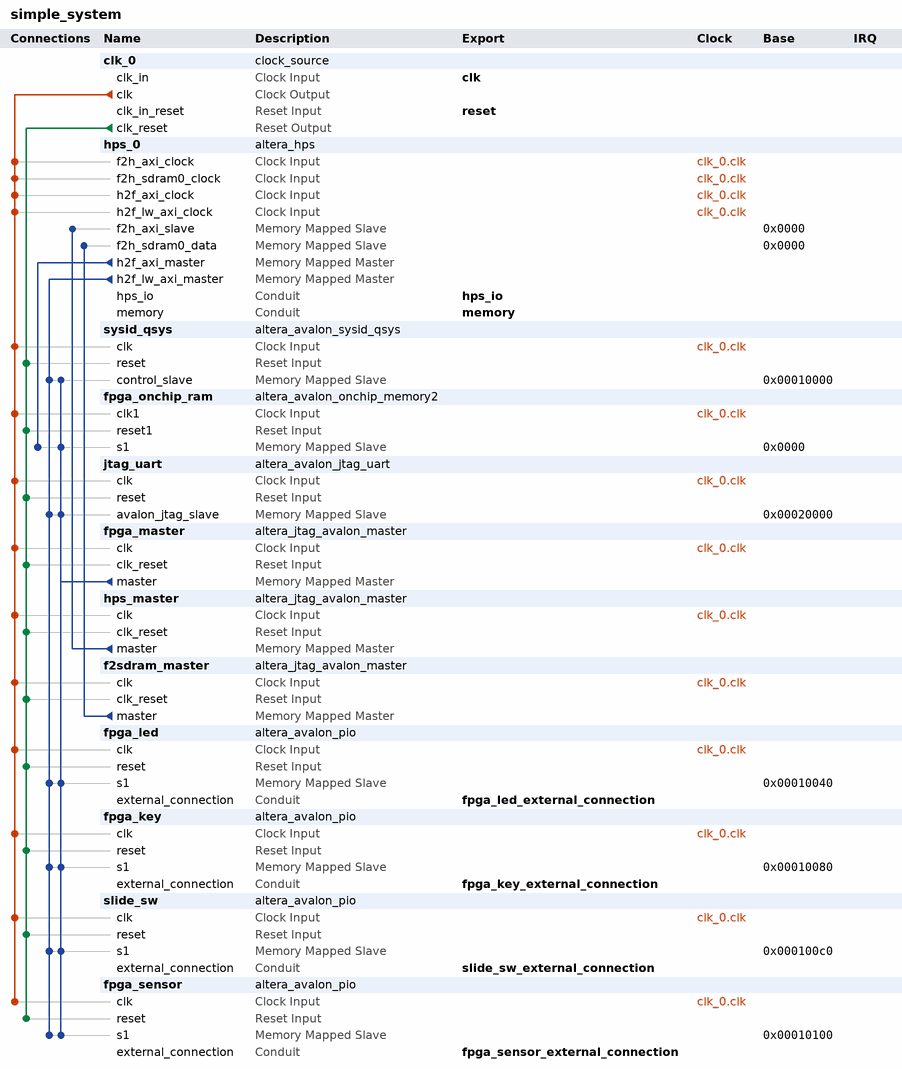
[diagram p0: system contents]
# Platform Designer (Qsys) system simple_system, Cyclone V 5CSXFC6C6U23C6
# Parameters at their usual value, and those the tool derives, are not listed.
package require -exact qsys 13.1
create_system simple_system
set_project_property DEVICE_FAMILY {Cyclone V}
set_project_property DEVICE 5CSXFC6C6U23C6

add_instance clk_0 clock_source 13.1
set_instance_parameter_value clk_0 clockFrequency 25000000

add_instance hps_0 altera_hps 13.1
set_instance_parameter_value hps_0 MEM_VENDOR JEDEC
set_instance_parameter_value hps_0 MEM_CLK_FREQ_MAX 333.333
set_instance_parameter_value hps_0 MEM_ROW_ADDR_WIDTH 14
set_instance_parameter_value hps_0 MEM_COL_ADDR_WIDTH 10
set_instance_parameter_value hps_0 MEM_DQ_WIDTH 32
set_instance_parameter_value hps_0 MEM_BANKADDR_WIDTH 3
set_instance_parameter_value hps_0 MEM_BL 8
set_instance_parameter_value hps_0 MEM_DRV_STR 34.3
set_instance_parameter_value hps_0 MEM_RTT_NOM {ODT Disabled}
set_instance_parameter_value hps_0 MEM_RTT_WR {Dynamic ODT off}
set_instance_parameter_value hps_0 MEM_WTCL 6
set_instance_parameter_value hps_0 MEM_TCL 7
set_instance_parameter_value hps_0 TIMING_TIS 410
set_instance_parameter_value hps_0 TIMING_TIH 410
set_instance_parameter_value hps_0 TIMING_TDS 390
set_instance_parameter_value hps_0 TIMING_TDH 390
set_instance_parameter_value hps_0 TIMING_TDQSQ 260
set_instance_parameter_value hps_0 TIMING_TDQSCK 4000
set_instance_parameter_value hps_0 TIMING_TDQSS 1.0
set_instance_parameter_value hps_0 TIMING_TQSH 0.38
set_instance_parameter_value hps_0 MEM_TMRD_CK 3
set_instance_parameter_value hps_0 MEM_TRAS_NS 70.0
set_instance_parameter_value hps_0 MEM_TRCD_NS 18.0
set_instance_parameter_value hps_0 MEM_TRP_NS 18.0
set_instance_parameter_value hps_0 MEM_TREFI_US 15.6
set_instance_parameter_value hps_0 MEM_TRFC_NS 130.0
set_instance_parameter_value hps_0 MEM_TWR_NS 18.0
set_instance_parameter_value hps_0 MEM_TWTR 3
set_instance_parameter_value hps_0 MEM_TFAW_NS 60.0
set_instance_parameter_value hps_0 MEM_TRRD_NS 10.0
set_instance_parameter_value hps_0 MEM_TRTP_NS 10.0
set_instance_parameter_value hps_0 REF_CLK_FREQ 25.0
set_instance_parameter_value hps_0 DEFAULT_FAST_SIM_MODEL true
set_instance_parameter_value hps_0 TIMING_BOARD_MAX_CK_DELAY 0.6
set_instance_parameter_value hps_0 TIMING_BOARD_MAX_DQS_DELAY 0.6
set_instance_parameter_value hps_0 TIMING_BOARD_SKEW_CKDQS_DIMM_MIN -0.01
set_instance_parameter_value hps_0 TIMING_BOARD_SKEW_CKDQS_DIMM_MAX 0.01
set_instance_parameter_value hps_0 TIMING_BOARD_SKEW_WITHIN_DQS 0.02
set_instance_parameter_value hps_0 TIMING_BOARD_SKEW_BETWEEN_DQS 0.02
set_instance_parameter_value hps_0 TIMING_BOARD_DQ_TO_DQS_SKEW 0.0
set_instance_parameter_value hps_0 TIMING_BOARD_AC_SKEW 0.02
set_instance_parameter_value hps_0 TIMING_BOARD_AC_TO_CK_SKEW 0.0
set_instance_parameter_value hps_0 MEM_CLK_FREQ 333.0
set_instance_parameter_value hps_0 HPS_PROTOCOL LPDDR2
set_instance_parameter_value hps_0 STM_Enable false
set_instance_parameter_value hps_0 F2S_Width 2
set_instance_parameter_value hps_0 S2F_Width 2
set_instance_parameter_value hps_0 LWH2F_Enable true
set_instance_parameter_value hps_0 F2SDRAM_Type {Avalon-MM Bidirectional}
set_instance_parameter_value hps_0 F2SDRAM_Width 256
set_instance_parameter_value hps_0 F2SCLK_DBGRST_Enable false
set_instance_parameter_value hps_0 F2SCLK_WARMRST_Enable false
set_instance_parameter_value hps_0 F2SCLK_COLDRST_Enable false
set_instance_parameter_value hps_0 F2SINTERRUPT_Enable true
set_instance_parameter_value hps_0 EMAC1_PinMuxing {HPS I/O Set 0}
set_instance_parameter_value hps_0 EMAC1_Mode RGMII
set_instance_parameter_value hps_0 QSPI_PinMuxing {HPS I/O Set 0}
set_instance_parameter_value hps_0 QSPI_Mode {1 SS}
set_instance_parameter_value hps_0 SDIO_PinMuxing {HPS I/O Set 0}
set_instance_parameter_value hps_0 SDIO_Mode {4-bit Data}
set_instance_parameter_value hps_0 USB1_PinMuxing {HPS I/O Set 0}
set_instance_parameter_value hps_0 USB1_Mode SDR
set_instance_parameter_value hps_0 SPIM0_PinMuxing {HPS I/O Set 0}
set_instance_parameter_value hps_0 SPIM0_Mode {Single Slave Select}
set_instance_parameter_value hps_0 SPIM1_PinMuxing Unused
set_instance_parameter_value hps_0 SPIM1_Mode N/A
set_instance_parameter_value hps_0 UART0_PinMuxing {HPS I/O Set 0}
set_instance_parameter_value hps_0 UART0_Mode {No Flow Control}
set_instance_parameter_value hps_0 UART1_PinMuxing {HPS I/O Set 0}
set_instance_parameter_value hps_0 UART1_Mode {No Flow Control}
set_instance_parameter_value hps_0 I2C0_PinMuxing {HPS I/O Set 0}
set_instance_parameter_value hps_0 I2C0_Mode I2C
set_instance_parameter_value hps_0 I2C1_PinMuxing {HPS I/O Set 0}
set_instance_parameter_value hps_0 I2C1_Mode I2C
set_instance_parameter_value hps_0 CAN1_PinMuxing {HPS I/O Set 0}
set_instance_parameter_value hps_0 CAN1_Mode CAN
set_instance_parameter_value hps_0 S2FCLK_USER1CLK_Enable true
set_instance_parameter_value hps_0 S2FCLK_USER1CLK_FREQ 50
set_instance_parameter_value hps_0 FPGA_PERIPHERAL_OUTPUT_CLOCK_FREQ_EMAC0_MD_CLK 100
set_instance_parameter_value hps_0 FPGA_PERIPHERAL_OUTPUT_CLOCK_FREQ_EMAC0_GTX_CLK 100
set_instance_parameter_value hps_0 FPGA_PERIPHERAL_OUTPUT_CLOCK_FREQ_EMAC1_MD_CLK 100
set_instance_parameter_value hps_0 FPGA_PERIPHERAL_OUTPUT_CLOCK_FREQ_EMAC1_GTX_CLK 100

add_instance sysid_qsys altera_avalon_sysid_qsys 13.1
set_instance_parameter_value sysid_qsys id 4660

add_instance fpga_onchip_ram altera_avalon_onchip_memory2 13.1
set_instance_parameter_value fpga_onchip_ram dataWidth 64
set_instance_parameter_value fpga_onchip_ram dualPort false
set_instance_parameter_value fpga_onchip_ram initMemContent true
set_instance_parameter_value fpga_onchip_ram initializationFileName onchip_mem.hex
set_instance_parameter_value fpga_onchip_ram memorySize 65536

add_instance jtag_uart altera_avalon_jtag_uart 13.1
set_instance_parameter_value jtag_uart allowMultipleConnections true
set_instance_parameter_value jtag_uart simInteractiveOptions NO_INTERACTIVE_WINDOWS

add_instance fpga_master altera_jtag_avalon_master 13.1

add_instance hps_master altera_jtag_avalon_master 13.1

add_instance f2sdram_master altera_jtag_avalon_master 13.1

add_instance fpga_led altera_avalon_pio 13.1
set_instance_parameter_value fpga_led direction Output
set_instance_parameter_value fpga_led width 4

add_instance fpga_key altera_avalon_pio 13.1
set_instance_parameter_value fpga_key captureEdge true
set_instance_parameter_value fpga_key direction Input
set_instance_parameter_value fpga_key width 4

add_instance slide_sw altera_avalon_pio 13.1
set_instance_parameter_value slide_sw captureEdge true
set_instance_parameter_value slide_sw direction Input
set_instance_parameter_value slide_sw width 4

add_instance fpga_sensor altera_avalon_pio 13.1
set_instance_parameter_value fpga_sensor direction Input
set_instance_parameter_value fpga_sensor width 4

# connections
add_connection clk_0.clk f2sdram_master.clk clock
add_connection clk_0.clk fpga_key.clk clock
add_connection clk_0.clk fpga_led.clk clock
add_connection clk_0.clk fpga_master.clk clock
add_connection clk_0.clk fpga_onchip_ram.clk1 clock
add_connection clk_0.clk fpga_sensor.clk clock
add_connection clk_0.clk hps_0.f2h_axi_clock clock
add_connection clk_0.clk hps_0.f2h_sdram0_clock clock
add_connection clk_0.clk hps_0.h2f_axi_clock clock
add_connection clk_0.clk hps_0.h2f_lw_axi_clock clock
add_connection clk_0.clk hps_master.clk clock
add_connection clk_0.clk jtag_uart.clk clock
add_connection clk_0.clk slide_sw.clk clock
add_connection clk_0.clk sysid_qsys.clk clock
add_connection clk_0.clk_reset f2sdram_master.clk_reset reset
add_connection clk_0.clk_reset fpga_key.reset reset
add_connection clk_0.clk_reset fpga_led.reset reset
add_connection clk_0.clk_reset fpga_master.clk_reset reset
add_connection clk_0.clk_reset fpga_onchip_ram.reset1 reset
add_connection clk_0.clk_reset fpga_sensor.reset reset
add_connection clk_0.clk_reset hps_master.clk_reset reset
add_connection clk_0.clk_reset jtag_uart.reset reset
add_connection clk_0.clk_reset slide_sw.reset reset
add_connection clk_0.clk_reset sysid_qsys.reset reset
add_connection f2sdram_master.master hps_0.f2h_sdram0_data avalon
set_connection_parameter_value f2sdram_master.master/hps_0.f2h_sdram0_data baseAddress 0x0000
add_connection fpga_master.master fpga_key.s1 avalon
set_connection_parameter_value fpga_master.master/fpga_key.s1 baseAddress 0x00010080
add_connection fpga_master.master fpga_led.s1 avalon
set_connection_parameter_value fpga_master.master/fpga_led.s1 baseAddress 0x00010040
add_connection fpga_master.master fpga_onchip_ram.s1 avalon
set_connection_parameter_value fpga_master.master/fpga_onchip_ram.s1 baseAddress 0x0000
add_connection fpga_master.master fpga_sensor.s1 avalon
set_connection_parameter_value fpga_master.master/fpga_sensor.s1 baseAddress 0x00010100
add_connection fpga_master.master jtag_uart.avalon_jtag_slave avalon
set_connection_parameter_value fpga_master.master/jtag_uart.avalon_jtag_slave baseAddress 0x00020000
add_connection fpga_master.master slide_sw.s1 avalon
set_connection_parameter_value fpga_master.master/slide_sw.s1 baseAddress 0x000100c0
add_connection fpga_master.master sysid_qsys.control_slave avalon
set_connection_parameter_value fpga_master.master/sysid_qsys.control_slave baseAddress 0x00010000
add_connection hps_0.h2f_axi_master fpga_onchip_ram.s1 avalon
set_connection_parameter_value hps_0.h2f_axi_master/fpga_onchip_ram.s1 baseAddress 0x0000
add_connection hps_0.h2f_lw_axi_master fpga_key.s1 avalon
set_connection_parameter_value hps_0.h2f_lw_axi_master/fpga_key.s1 baseAddress 0x00010080
add_connection hps_0.h2f_lw_axi_master fpga_led.s1 avalon
set_connection_parameter_value hps_0.h2f_lw_axi_master/fpga_led.s1 baseAddress 0x00010040
add_connection hps_0.h2f_lw_axi_master fpga_sensor.s1 avalon
set_connection_parameter_value hps_0.h2f_lw_axi_master/fpga_sensor.s1 baseAddress 0x00010100
add_connection hps_0.h2f_lw_axi_master jtag_uart.avalon_jtag_slave avalon
set_connection_parameter_value hps_0.h2f_lw_axi_master/jtag_uart.avalon_jtag_slave baseAddress 0x00020000
add_connection hps_0.h2f_lw_axi_master slide_sw.s1 avalon
set_connection_parameter_value hps_0.h2f_lw_axi_master/slide_sw.s1 baseAddress 0x000100c0
add_connection hps_0.h2f_lw_axi_master sysid_qsys.control_slave avalon
set_connection_parameter_value hps_0.h2f_lw_axi_master/sysid_qsys.control_slave baseAddress 0x00010000
add_connection hps_master.master hps_0.f2h_axi_slave avalon
set_connection_parameter_value hps_master.master/hps_0.f2h_axi_slave baseAddress 0x0000

# exported interfaces
add_interface clk clock sink
set_interface_property clk EXPORT_OF clk_0.clk_in
add_interface fpga_key_external_connection conduit end
set_interface_property fpga_key_external_connection EXPORT_OF fpga_key.external_connection
add_interface fpga_led_external_connection conduit end
set_interface_property fpga_led_external_connection EXPORT_OF fpga_led.external_connection
add_interface fpga_sensor_external_connection conduit end
set_interface_property fpga_sensor_external_connection EXPORT_OF fpga_sensor.external_connection
add_interface hps_io conduit end
set_interface_property hps_io EXPORT_OF hps_0.hps_io
add_interface memory conduit end
set_interface_property memory EXPORT_OF hps_0.memory
add_interface reset reset sink
set_interface_property reset EXPORT_OF clk_0.clk_in_reset
add_interface slide_sw_external_connection conduit end
set_interface_property slide_sw_external_connection EXPORT_OF slide_sw.external_connection

set_interconnect_requirement {$system} qsys_mm.clockCrossingAdapter HANDSHAKE
set_interconnect_requirement {$system} qsys_mm.maxAdditionalLatency 1
set_interconnect_requirement {$system} qsys_mm.insertDefaultSlave FALSE

save_system simple_system.qsys
